# Altium schematic sheet P05 Power Supply2.SchDoc
size 420 x 297 mm
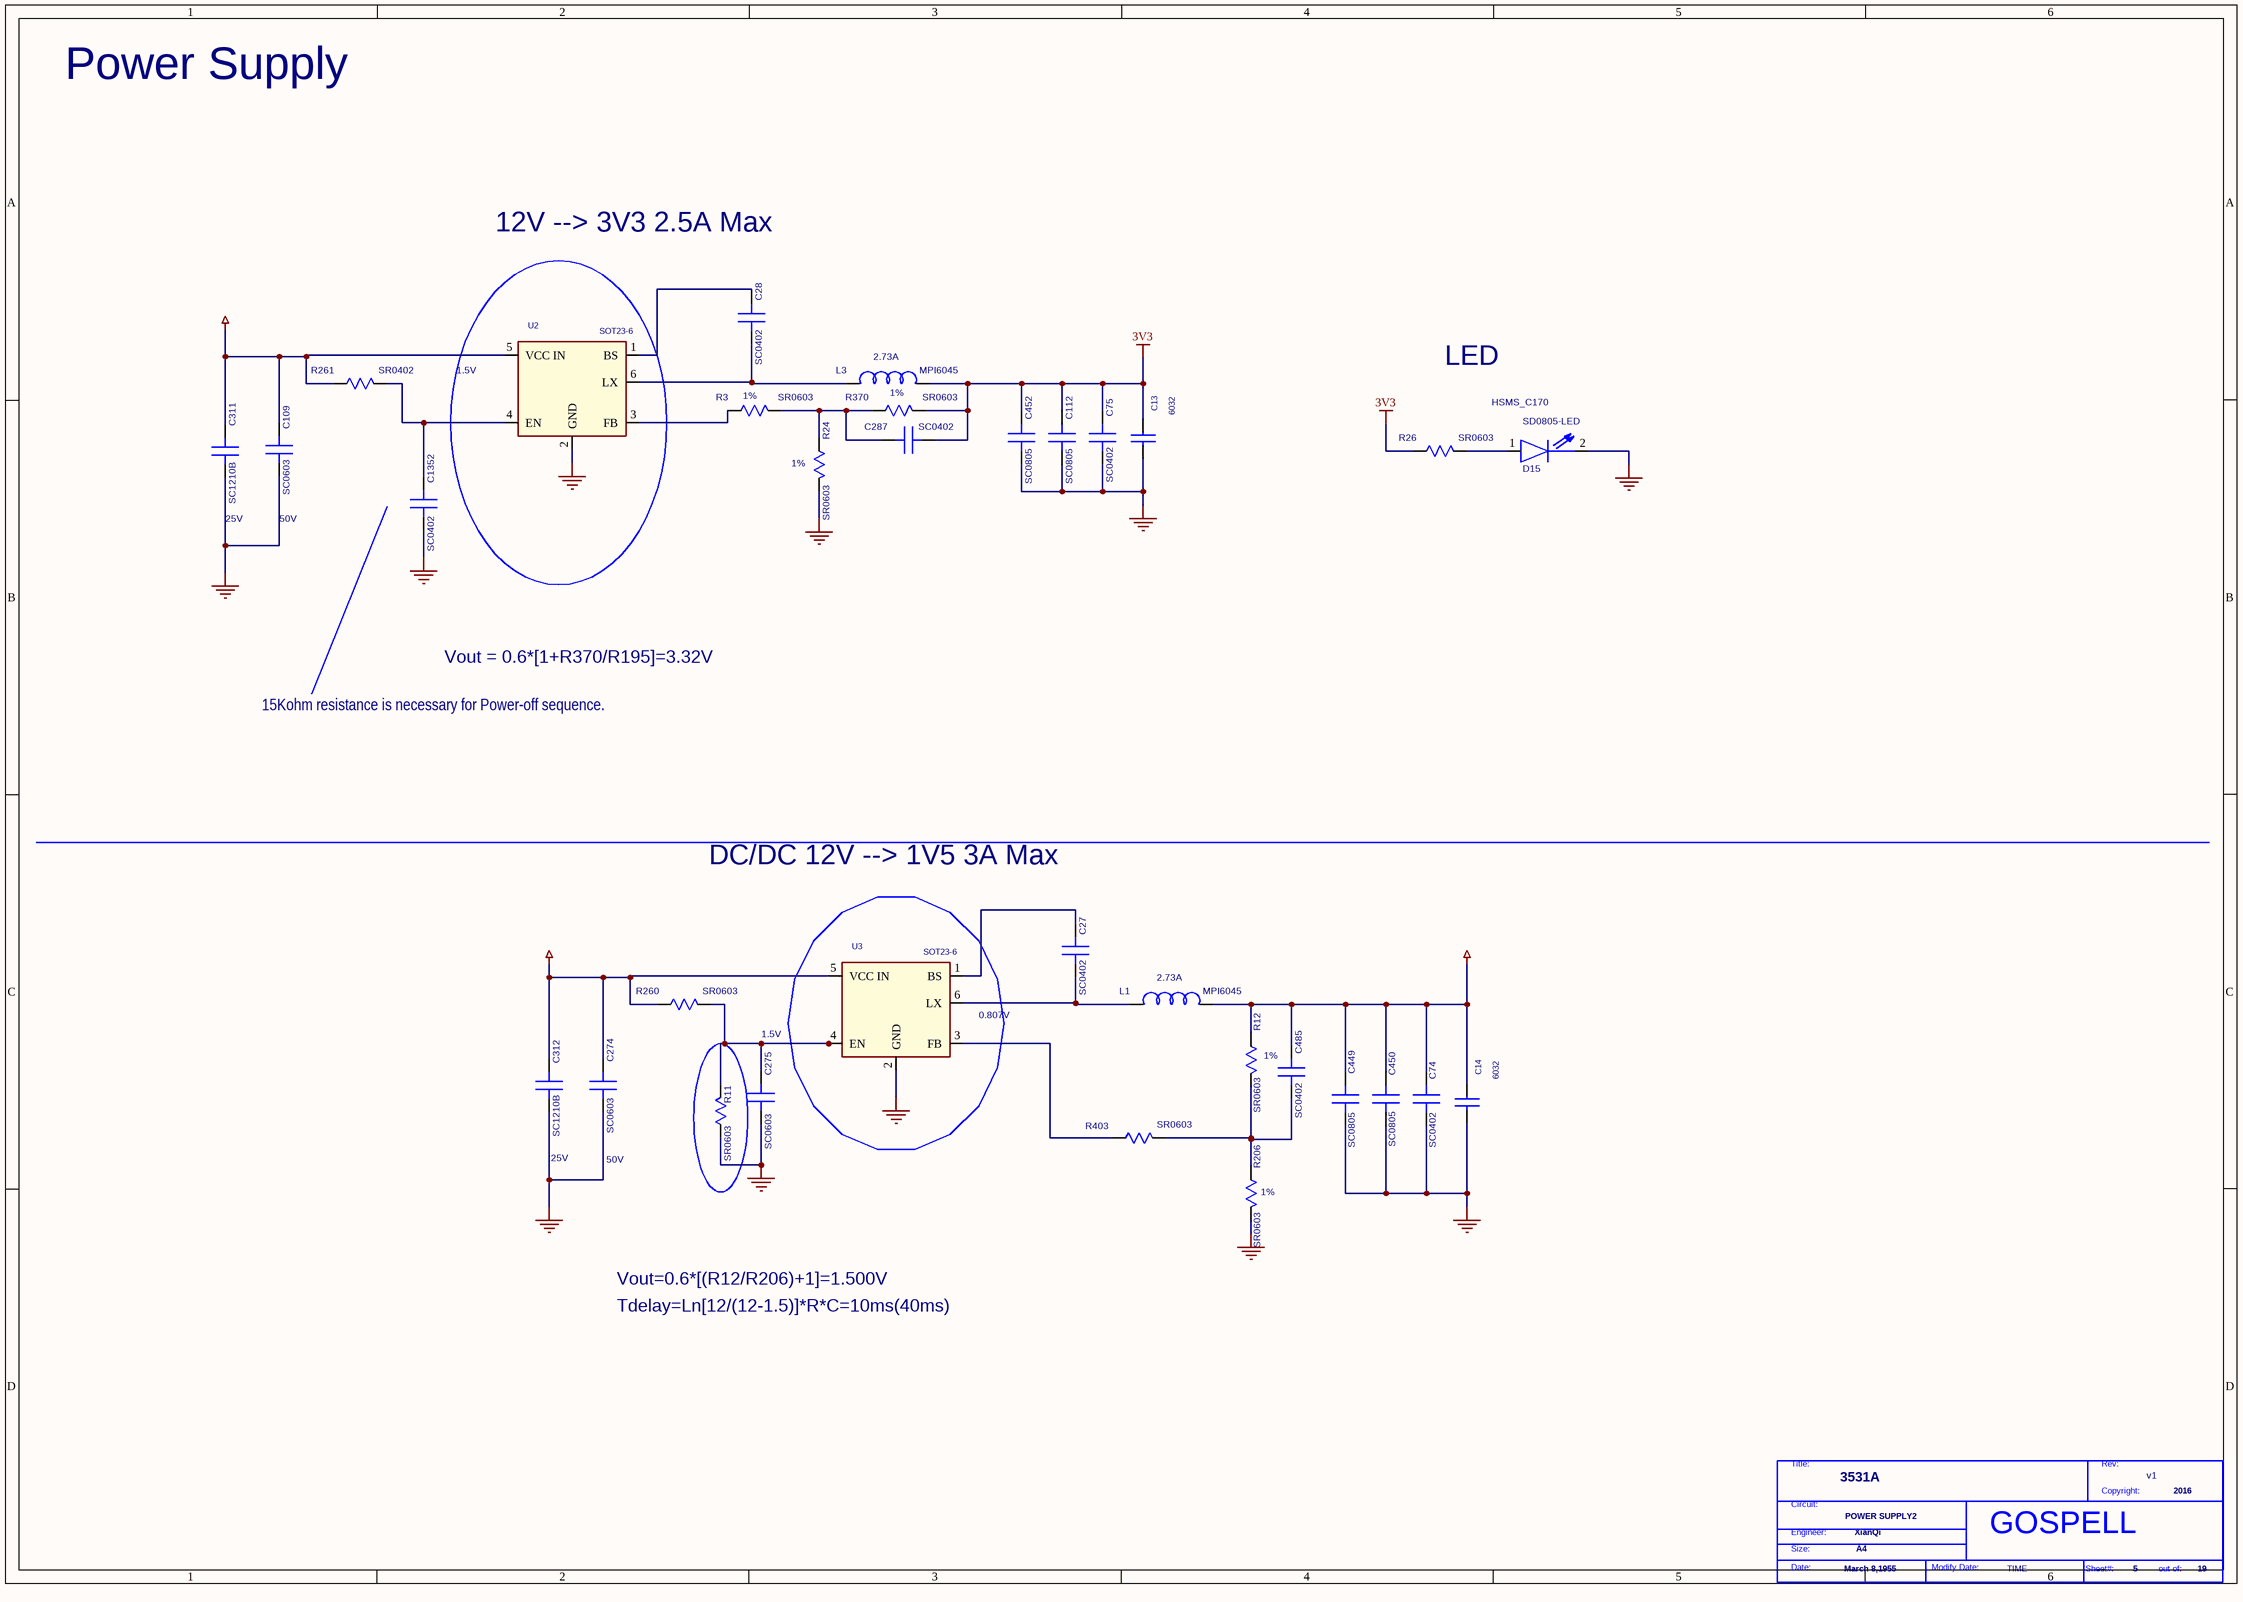
[diagram p0: P05 Power Supply2.SchDoc]

## Parts
*  Page Modify Date: TIME  Engineer: XianQi  Copyright: 2016  Title: 3531A  RevCode: v1  Page Size: A4  Page Create Date: March 8,1955  Page Number: 5  Page Count: 19  Doc: POWER SUPPLY2  (hidden comment: GOSPELL)  (graphical)
C13  6032  [6032]
C14  6032  [6032]
C27  SC0402  [SC0402]
C28  SC0402  [SC0402]
C74  SC0402  [SC0402]
C75  SC0402  [SC0402]
C109  SC0603  [SC0603]
C112  SC0805  [SC0805]
C274  SC0603  [SC0603]
C275  SC0603  [SC0603]
C287  SC0402  [SC0402]
C311  SC1210B  [SC1210B]
C312  SC1210B  [SC1210B]
C449  SC0805  [SC0805]
C450  SC0805  [SC0805]
C452  SC0805  [SC0805]
C485  SC0402  [SC0402]
C1352  SC0402  [SC0402]
D15  SD0805-LED  DEVICE: HSMS_C170  [SD0805-LED]
L1  MPI6045  [MPI6045]
L3  MPI6045  [MPI6045]
R3  SR0603  [SR0603]
R11  SR0603  [SR0603]
R12  SR0603  [SR0603]
R24  SR0603  [SR0603]
R26  SR0603  [SR0603]
R206  SR0603  [SR0603]
R260  SR0603  [SR0603]
R261  SR0402  [SR0402]
R370  SR0603  [SR0603]
R403  SR0603  [SR0603]
U2  SOT23-6  [SOT23-6]
U3  SOT23-6  [SOT23-6]

## Nets
1V5: C14.1 C74.1(A) C449.1(A) C450.1(A) C485.1(A) L1.2(B) R12.1(A)
3V3: C13.1 C75.1(A) C112.1(A) C287.2(B) C452.1(A) L3.2(B) R26.1(A) R370.2(B)
12V0: C109.1(A) C274.1(A) C311.1(A) C312.1(A) R260.1(A) R261.1(A) U2.5(VCC_IN) U3.5(VCC_IN)
GND: C13.2 C14.2 C74.2(B) C75.2(B) C109.2(B) C112.2(B) C274.2(B) C275.2(B) C311.2(B) C312.2(B) C449.2(B) C450.2(B) C452.2(B) C1352.2(B) D15.2(B) R11.1(A) R24.2(B) R206.2(B) U2.2(GND) U3.2(GND)
NetC27_1: C27.1(A) U3.1(BS)
NetC27_2: C27.2(B) L1.1(A) U3.6(LX)
NetC28_1: C28.1(A) U2.1(BS)
NetC28_2: C28.2(B) L3.1(A) U2.6(LX)
NetC275_1: C275.1(A) R11.2(B) R260.2(B) U3.4(EN)
NetC287_1: C287.1(A) R3.2(B) R24.1(A) R370.1(A)
NetC485_2: C485.2(B) R12.2(B) R206.1(A) R403.2(B)
NetC1352_1: C1352.1(A) R261.2(B) U2.4(EN)
NetD15_1: D15.1(A) R26.2(B)
NetR3_1: R3.1(A) U2.3(FB)
NetR403_1: R403.1(A) U3.3(FB)

## Notes on the sheet
- Power Supply
- 12V --> 3V3 2.5A Max
- (near U2) 1.5V
- (near R3) 1%
- (near L3) 2.73A
- 1%
- LED
- 25V
- 50V
- (near R24) 1%
- Vout = 0.6*[1+R370/R195]=3.32V
- 15Kohm resistance is necessary for Power-off sequence.
- DC/DC 12V --> 1V5 3A Max
- (near L1) 2.73A
- 1.5V
- (near U3) 0.807V
- (near R206) 1%
- Tdelay=Ln[12/(12-1.5)]*R*C=10ms(40ms)
- Vout=0.6*[(R12/R206)+1]=1.500V
- (in symbol GOSPELL) Title:; Rev:; Copyright:; Circuit:; Engineer:; Size:; Date:; Modify Date:; Sheet#:; out of:

## Library data of the parts
C13 C14 = CAP NP
C27 C28 = C_0_Dup2: PARTS: 1; PINSWAP: (A,B); LEVEL: STD; DEVICE: RMEMK105BJ104KV_FR; OriginalSymbolOrigin: (0,30); CODE: 8070614; %195%%232%%202%%246%: SMD陶瓷电容-16V-100NF-+/-10%-X7R-0402-BT; %182%%238%%182%%168%%185%%164%%215%%247%%181%%231%%209%%185%(V): 16; COMPONENT_HIGH_MAX: 0.55MM; %208%%161%%192%%224%%195%%251%%179%%198%: SMD陶瓷电容; PKG_TYPE: SC0402
C74 = C_0_Dup2: PARTS: 1; PINSWAP: (A,B); LEVEL: STD; DEVICE: RMEMK105BJ104KV_FR; OriginalSymbolOrigin: (0,30); %208%%161%%192%%224%%195%%251%%179%%198%: SMD陶瓷电容; COMPONENT_HIGH_MAX: 0.6MM; %182%%238%%182%%168%%185%%164%%215%%247%%181%%231%%209%%185%(V): 16; %195%%232%%202%%246%: SMD陶瓷电容-16V-100NF-+/-10%-X7R-0402-BT; CODE: 8070614; PKG_TYPE: SC0402
C75 = C_0_Dup2: PARTS: 1; PINSWAP: (A,B); LEVEL: STD; DEVICE: RMEMK105BJ104KV_FR; OriginalSymbolOrigin: (0,30); CODE: 8070614; %195%%232%%202%%246%: SMD陶瓷电容-16V-100NF-+/-10%-X7R-0402-BT; %182%%238%%182%%168%%185%%164%%215%%247%%181%%231%%209%%185%(V): 16; COMPONENT_HIGH_MAX: 0.6MM; %208%%161%%192%%224%%195%%251%%179%%198%: SMD陶瓷电容; PKG_TYPE: SC0402
C109 C274 = C_0_Dup2: PARTS: 1; PINSWAP: (A,B); LEVEL: STD; DEVICE: C1608X7R1H104KT000N; OriginalSymbolOrigin: (0,30); %208%%161%%192%%224%%195%%251%%179%%198%: SMD陶瓷电容; COMPONENT_HIGH_MAX: 0.9MM; %182%%238%%182%%168%%185%%164%%215%%247%%181%%231%%209%%185%(V): 50; %195%%232%%202%%246%: SMD陶瓷电容-50V-100NF-+/-10%-X7R-0603; CODE: 8070627; PKG_TYPE: SC0603
C112 C449 C450 = C_0_Dup2: PARTS: 1; PINSWAP: (A,B); LEVEL: STD; DEVICE: C2012X5R0J226MT000N; OriginalSymbolOrigin: (0,30); %208%%161%%192%%224%%195%%251%%179%%198%: SMD陶瓷电容; COMPONENT_HIGH_MAX: 1.35MM; %182%%238%%182%%168%%185%%164%%215%%247%%181%%231%%209%%185%(V): 6.3; %195%%232%%202%%246%: SMD陶瓷电容-6.3V-22000NF-+/-20%-X5R-0805-08070784编码拆分供华为技术使用; CODE: 8071114; PKG_TYPE: SC0805
C275 = C_0_Dup2: PARTS: 1; PINSWAP: (A,B); LEVEL: STD; DEVICE: CV05X5R105K10AH; OriginalSymbolOrigin: (0,30); %208%%161%%192%%224%%195%%251%%179%%198%: SMD陶瓷电容; COMPONENT_HIGH_MAX: 0.55MM; %182%%238%%182%%168%%185%%164%%215%%247%%181%%231%%209%%185%(V): 10; %195%%232%%202%%246%: SMD陶瓷电容-10V-1000NF-+/-10%-X5R-0402-BT,TS16949; CODE: 8070612; PKG_TYPE: SC0603
C287 = C_0_Dup2: PARTS: 1; PINSWAP: (A,B); LEVEL: STD; DEVICE: C0402C150J5GAC_7867; OriginalSymbolOrigin: (0,30); CODE: 8070544; %195%%232%%202%%246%: SMD陶瓷电容-50V-0.015NF-+/-5%-NP0-0402; %182%%238%%182%%168%%185%%164%%215%%247%%181%%231%%209%%185%(V): 50; COMPONENT_HIGH_MAX: 0.55MM; %208%%161%%192%%224%%195%%251%%179%%198%: SMD陶瓷电容; PKG_TYPE: SC0402
C311 = C_0_Dup2: PARTS: 1; PINSWAP: (A,B); LEVEL: STD; DEVICE: CETMK325B7226KM_T; OriginalSymbolOrigin: (0,30); %208%%161%%192%%224%%195%%251%%179%%198%: SMD陶瓷电容; COMPONENT_HIGH_MAX: 2.7MM; %182%%238%%182%%168%%185%%164%%215%%247%%181%%231%%209%%185%(V): 25; %195%%232%%202%%246%: SMD陶瓷电容-25V-22000NF-+/-10%-X7R-1210-所有; CODE: 8070825; PKG_TYPE: SC1210B
C312 = C_0_Dup2: PARTS: 1; PINSWAP: (A,B); LEVEL: STD; DEVICE: CETMK325B7226KM_T; OriginalSymbolOrigin: (0,30); CODE: 8070825; %195%%232%%202%%246%: SMD陶瓷电容-25V-22000NF-+/-10%-X7R-1210-所有; %182%%238%%182%%168%%185%%164%%215%%247%%181%%231%%209%%185%(V): 25; COMPONENT_HIGH_MAX: 2.7MM; %208%%161%%192%%224%%195%%251%%179%%198%: SMD陶瓷电容; PKG_TYPE: SC1210B
C452 = C_0_Dup2: PARTS: 1; PINSWAP: (A,B); LEVEL: STD; DEVICE: C2012X5R0J226MT000N; OriginalSymbolOrigin: (0,30); CODE: 8071114; %195%%232%%202%%246%: SMD陶瓷电容-6.3V-22000NF-+/-20%-X5R-0805-08070784编码拆分供华为技术使用; %182%%238%%182%%168%%185%%164%%215%%247%%181%%231%%209%%185%(V): 6.3; COMPONENT_HIGH_MAX: 1.35MM; %208%%161%%192%%224%%195%%251%%179%%198%: SMD陶瓷电容; PKG_TYPE: SC0805
C485 = C_0_Dup2: PARTS: 1; PINSWAP: (A,B); LEVEL: STD; DEVICE: C0402C150J5GAC_7867; OriginalSymbolOrigin: (0,30); %208%%161%%192%%224%%195%%251%%179%%198%: SMD陶瓷电容; COMPONENT_HIGH_MAX: 0.55MM; %182%%238%%182%%168%%185%%164%%215%%247%%181%%231%%209%%185%(V): 50; %195%%232%%202%%246%: SMD陶瓷电容-50V-0.015NF-+/-5%-NP0-0402; CODE: 8070544; PKG_TYPE: SC0402
C1352 = C_0_Dup2: PARTS: 1; PINSWAP: (A,B); LEVEL: STD; DEVICE: RK73B1ETTP273J; OriginalSymbolOrigin: (0,30); %208%%161%%192%%224%%195%%251%%179%%198%: 片式厚膜电阻器; COMPONENT_HIGH_MAX: 0.4MM; %182%%238%%182%%168%%185%%164%%215%%247%%181%%231%%209%%185%(V): 10; %195%%232%%202%%246%: 片式厚膜电阻器-0.0625W-27000OHM-+/-5%-0402; CODE: 07090852; PKG_TYPE: SC0402
D15 = LED_1: PARTS: 1; LEVEL: STD; CODE: 15020062; OriginalSymbolOrigin: (10,20); %195%%232%%202%%246%: 发光二极管-0.015CD-红色/630NM-15MA-0805; COMPONENT_HIGH_MAX: 1.1MM; %208%%161%%192%%224%%195%%251%%179%%198%: 发光二极管; PKG_TYPE: SD0805-LED
L1 L3 = L_0_Dup1: PARTS: 1; DEVICE: LMNRS5040T4R7NMGK; LEVEL: STD; PKG_TYPE: SPL0505H; OriginalSymbolOrigin: (20,20); COMPONENT_HIGH_MAX: 4.1MM; %195%%232%%202%%246%: 功率电感-4.7UH-+/-30%-2.73A-0.039OHM-5.0*5.0*4.1MM-SMT-3.18A-00821851; CODE: 10100577
R3 = R_1: PARTS: 1; LEVEL: STD; DEVICE: RK73H1JTTD3012F; PINSWAP: (A,B); OriginalSymbolOrigin: (10,20); %208%%161%%192%%224%%195%%251%%179%%198%: 片式厚膜电阻器; COMPONENT_HIGH_MAX: 0.55MM; %215%%232%%214%%181%%212%%202%%208%%237%%198%%171%%178%%238%: +/-1%; %182%%238%%182%%168%%185%%166%%194%%202%(W): 0.1; %195%%232%%202%%246%: 片式厚膜电阻器-0.1W-30100OHM-+/-1%-0603; CODE: 7090531; PKG_TYPE: SR0603
R11 = R_1: PARTS: 1; LEVEL: STD; DEVICE: RC_02W3923FT; PINSWAP: (A,B); OriginalSymbolOrigin: (10,20); CODE: 7091395; %195%%232%%202%%246%: 片式厚膜电阻器-0.0625W-392000OHM-+/-1%-0402; %182%%238%%182%%168%%185%%166%%194%%202%(W): 0.06; %215%%232%%214%%181%%212%%202%%208%%237%%198%%171%%178%%238%: +/-1%; COMPONENT_HIGH_MAX: 0.4MM; %208%%161%%192%%224%%195%%251%%179%%198%: 片式厚膜电阻器; PKG_TYPE: SR0603
R12 = R_1: PARTS: 1; LEVEL: STD; DEVICE: RHS_03K2322FT; PINSWAP: (A,B); OriginalSymbolOrigin: (10,20); %208%%161%%192%%224%%195%%251%%179%%198%: 片式厚膜电阻器; COMPONENT_HIGH_MAX: 0.55MM; %215%%232%%214%%181%%212%%202%%208%%237%%198%%171%%178%%238%: +/-1%; %182%%238%%182%%168%%185%%166%%194%%202%(W): 0.1; %195%%232%%202%%246%: 片式厚膜电阻器-0.1W-23200OHM-+/-1%-0603; CODE: 7090706; PKG_TYPE: SR0603
R24 = R_1: PARTS: 1; LEVEL: STD; DEVICE: RHS_03K1802FT; PINSWAP: (A,B); OriginalSymbolOrigin: (10,20); CODE: 7090982; %195%%232%%202%%246%: 片式厚膜电阻器-0.1W-18000OHM-+/-1%-0603; %182%%238%%182%%168%%185%%166%%194%%202%(W): 0.1; %215%%232%%214%%181%%212%%202%%208%%237%%198%%171%%178%%238%: +/-1%; COMPONENT_HIGH_MAX: 0.55MM; %208%%161%%192%%224%%195%%251%%179%%198%: 片式厚膜电阻器; PKG_TYPE: SR0603
R26 = R_1: PARTS: 1; LEVEL: STD; DEVICE: RC0603FR_07499R; PINSWAP: (A,B); OriginalSymbolOrigin: (10,20); CODE: 7090676; %195%%232%%202%%246%: 片式厚膜电阻器-0.1W-499OHM-+/-1%-0603; %182%%238%%182%%168%%185%%166%%194%%202%(W): 0.1; %215%%232%%214%%181%%212%%202%%208%%237%%198%%171%%178%%238%: +/-1%; COMPONENT_HIGH_MAX: 0.55MM; %208%%161%%192%%224%%195%%251%%179%%198%: 片式厚膜电阻器; PKG_TYPE: SR0603
R206 = R_1: PARTS: 1; LEVEL: STD; DEVICE: RK73H1JTTD2702F; PINSWAP: (A,B); OriginalSymbolOrigin: (10,20); %208%%161%%192%%224%%195%%251%%179%%198%: 片式厚膜电阻器; COMPONENT_HIGH_MAX: 0.55MM; %215%%232%%214%%181%%212%%202%%208%%237%%198%%171%%178%%238%: +/-1%; %182%%238%%182%%168%%185%%166%%194%%202%(W): 0.1; %195%%232%%202%%246%: 片式厚膜电阻器-0.1W-27000OHM-+/-1%-0603; CODE: 7090937; PKG_TYPE: SR0603
R260 = R_1: PARTS: 1; LEVEL: STD; DEVICE: RC_02W3923FT; PINSWAP: (A,B); OriginalSymbolOrigin: (10,20); %208%%161%%192%%224%%195%%251%%179%%198%: 片式厚膜电阻器; COMPONENT_HIGH_MAX: 0.4MM; %215%%232%%214%%181%%212%%202%%208%%237%%198%%171%%178%%238%: +/-1%; %182%%238%%182%%168%%185%%166%%194%%202%(W): 0.06; %195%%232%%202%%246%: 片式厚膜电阻器-0.0625W-392000OHM-+/-1%-0402; CODE: 7091395; PKG_TYPE: SR0603
R261 = R_1: PARTS: 1; LEVEL: STD; DEVICE: RK73H1ETTP1003F; PINSWAP: (A,B); OriginalSymbolOrigin: (10,20); CODE: 7090875; %195%%232%%202%%246%: 片式厚膜电阻器-0.0625W-100000OHM-+/-1%-0402; %182%%238%%182%%168%%185%%166%%194%%202%(W): 0.06; %215%%232%%214%%181%%212%%202%%208%%237%%198%%171%%178%%238%: +/-1%; COMPONENT_HIGH_MAX: 0.4MM; %208%%161%%192%%224%%195%%251%%179%%198%: 片式厚膜电阻器; PKG_TYPE: SR0402
R370 = R_1: PARTS: 1; LEVEL: STD; DEVICE: RHS_03K5622FT; PINSWAP: (A,B); OriginalSymbolOrigin: (10,20); CODE: 7090933; %195%%232%%202%%246%: 片式厚膜电阻器-0.1W-56200OHM-+/-1%-0603; %182%%238%%182%%168%%185%%166%%194%%202%(W): 0.1; %215%%232%%214%%181%%212%%202%%208%%237%%198%%171%%178%%238%: +/-1%; COMPONENT_HIGH_MAX: 0.55MM; %208%%161%%192%%224%%195%%251%%179%%198%: 片式厚膜电阻器; PKG_TYPE: SR0603
R403 = R_1: PARTS: 1; LEVEL: STD; DEVICE: RK73H1JTTD7502F; PINSWAP: (A,B); OriginalSymbolOrigin: (10,20); CODE: 7091238; %195%%232%%202%%246%: 片式厚膜电阻器-0.1W-75000OHM-+/-1%-0603; %182%%238%%182%%168%%185%%166%%194%%202%(W): 0.1; %215%%232%%214%%181%%212%%202%%208%%237%%198%%171%%178%%238%: +/-1%; COMPONENT_HIGH_MAX: 0.55MM; %208%%161%%192%%224%%195%%251%%179%%198%: 片式厚膜电阻器; PKG_TYPE: SR0603
U2 U3 = SY8120